# EAGLE design driverLED (EAGLE 6.3)
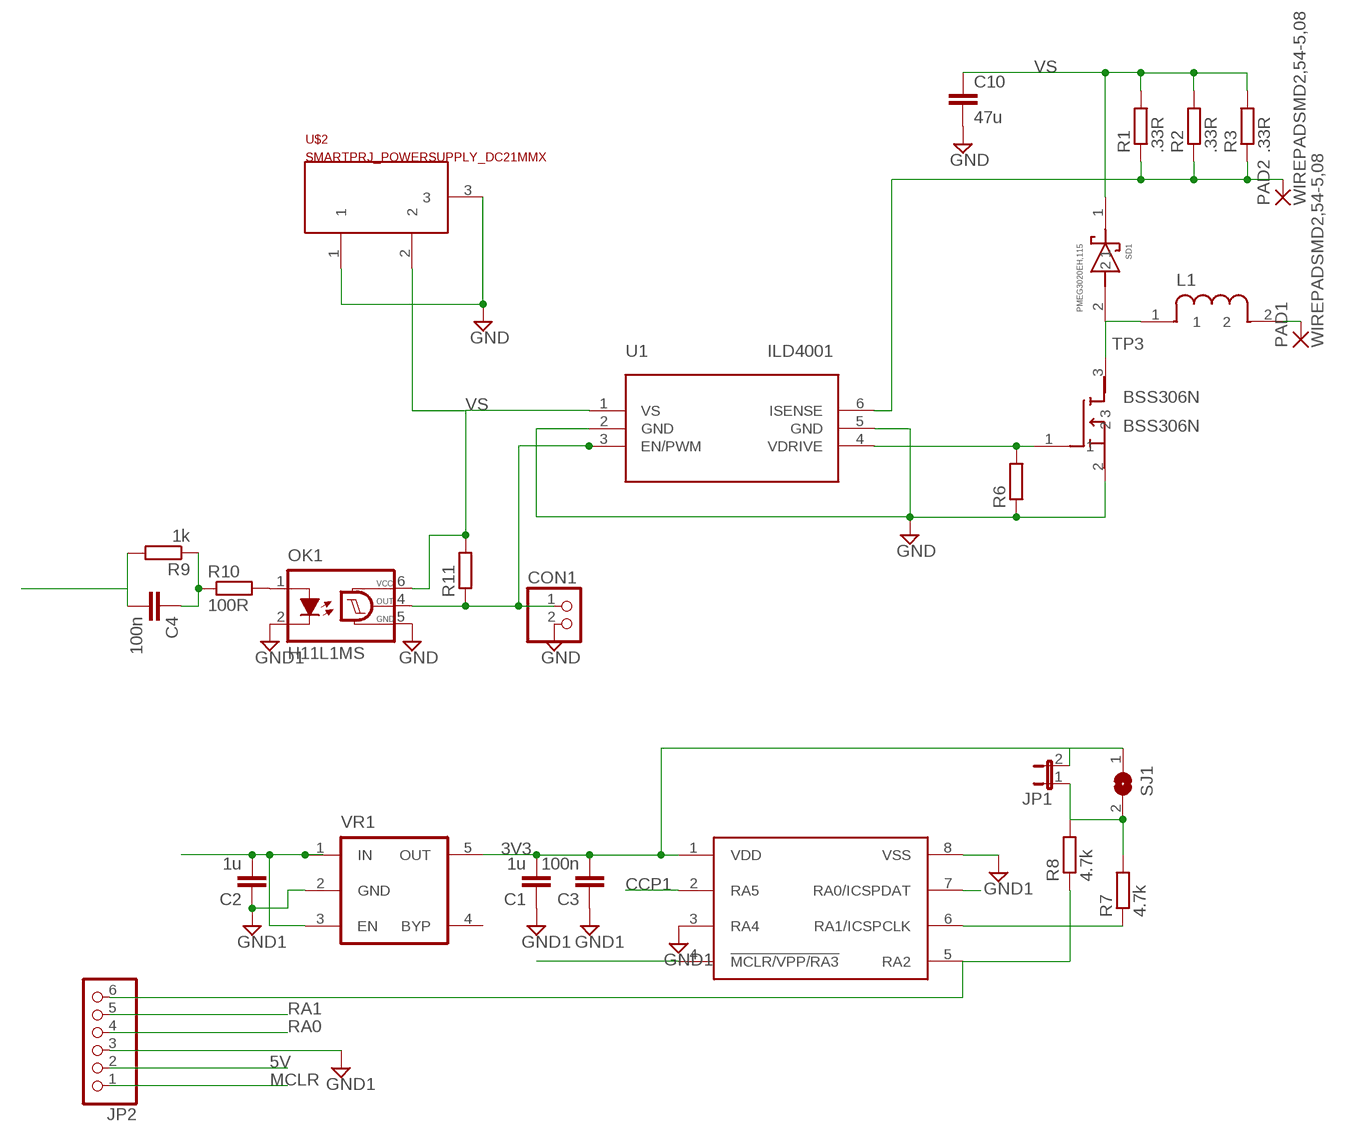
[diagram p0: schematic, sheet 1]

## Parts
BSS306N  BSS306N  [SOT23]
C1  1u  C-EUC0603  [C0603]
C2  1u  C-EUC0603  [C0603]
C3  100n  C-EUC0603  [C0603]
C4  100n  C-EUC0603  [C0603]
C10  47u  C-EUC1812  [C1812]
CON1  PINHD-1X2  [1X02]
JP1  JUMPER-2PTH  [1X02]
JP2  PINHD-1X6  [1X06]
L1  NR10050T470M  [NR10050T470M]
OK1  H11L1MS  [DIL6-SMD]
PAD1  WIREPADSMD2,54-5,08  [SMD2,54-5,08]
PAD2  WIREPADSMD2,54-5,08  [SMD2,54-5,08]
R1  .33R  R-EU_R1206  [R1206]
R2  .33R  R-EU_R1206  [R1206]
R3  .33R  R-EU_R1206  [R1206]
R6  R-EU_R0603  [R0603]
R7  4.7k  R-EU_R0603  [R0603]
R8  4.7k  R-EU_R0603  [R0603]
R9  1k  R-EU_R0603  [R0603]
R10  100R  R-EU_R0603  [R0603]
R11  R-EU_R0603  [R0603]
SD1  PMEG3020EH,115  [SOD123F]
SJ1  JUMPER_SJ  [JUMPER_SJ]
U1  ILD4001  [SC74]
U$1  PIC12F1822  [8-SOIC]
U$2  SMARTPRJ_POWERSUPPLY_DC21MMX  [SMARTPRJ_POWERSUPPLY_DC-21MM]
VR1  MIC5205  [SOT-23-5]

## Nets
3V3: C1.2 C3.2 JP1.2 SJ1.1 U$1.1(VDD) VR1.5(OUT)
5V: C2.2 JP2.2 VR1.1(IN) VR1.3(EN)
CCP1: C4.2 R9.2 U$1.2(RA5)
GND: BSS306N.2 C10.2 CON1.2 OK1.5(GND) R6.1 U1.2(GND) U1.5(GND) U$2.1 U$2.3
GND1: C1.1 C2.1 C3.1 JP2.3 OK1.2(C) U$1.3(RA4) U$1.8(VSS) VR1.2(GND)
MCLR: JP2.1 U$1.4(!MCLR/VPP/RA3)
N$1: OK1.1(A) R10.2
N$2: L1.2 PAD1.1(P)
N$4: BSS306N.1 R6.2 U1.4(VDRIVE)
N$8: JP1.1 R7.2 R8.2 SJ1.2
N$9: CON1.1 OK1.4(OUT) R11.1 U1.3(EN/PWM)
N$10: PAD2.1(P) R1.1 R2.1 R3.1 U1.6(ISENSE)
N$11: JP2.6 R8.1 U$1.5(RA2)
N$12: C4.1 R9.1 R10.1
RA0: JP2.4 U$1.7(RA0/ICSPDAT)
RA1: JP2.5 R7.1 U$1.6(RA1/ICSPCLK)
TP3: BSS306N.3 L1.1 SD1.2
VS: C10.1 OK1.6(VCC) R1.2 R2.2 R3.2 R11.2 SD1.1 U1.1(VS) U$2.2
Unconnected: VR1.4(BYP)

## Library data of the parts
BSS306N = lsel2014-2:BSS306N
C1-C4 C10 = resistor:C-EU: CAPACITOR, European symbol
CON1 = pinhead:PINHD-1X2: PIN HEADER
JP1 = SparkFun:JUMPER-2: Jumper Basic 0.1" spaced jumper. Use with breakaway headers.
JP2 = pinhead:PINHD-1X6: PIN HEADER
L1 = lsel2014-2:NR10050T470M
OK1 = optocoupler:H11L*M: 6-Pin DIP Optocoupler Source: http://www.fairchildsemi.com/ds/H1/H11L2-M.pdf; OC_FARNELL: unknown; OC_NEWARK: unknown
PAD1 PAD2 = wirepad:WIREPAD: Wire PAD connect wire on PCB
R1-R3 R10 = rcl:R-EU_: RESISTOR, European symbol
R6-R9 R11 = resistor:R-EU_: RESISTOR, European symbol
SD1 = lsel2014-2:PMEG3020EH,115
SJ1 = ADK_MEGA_2560-REV3:JUMPER_SJ: SMD solder JUMPER
U1 = lsel2014-2:ILD4001
U$1 = lsel2014-2:PIC12F1822
U$2 = Armduino_v1.3:SMARTPRJ_POWERSUPPLY_DC21MM
VR1 = dp_devices:MIC5205: 150ma Low-Noise LDO Regulator

## Board
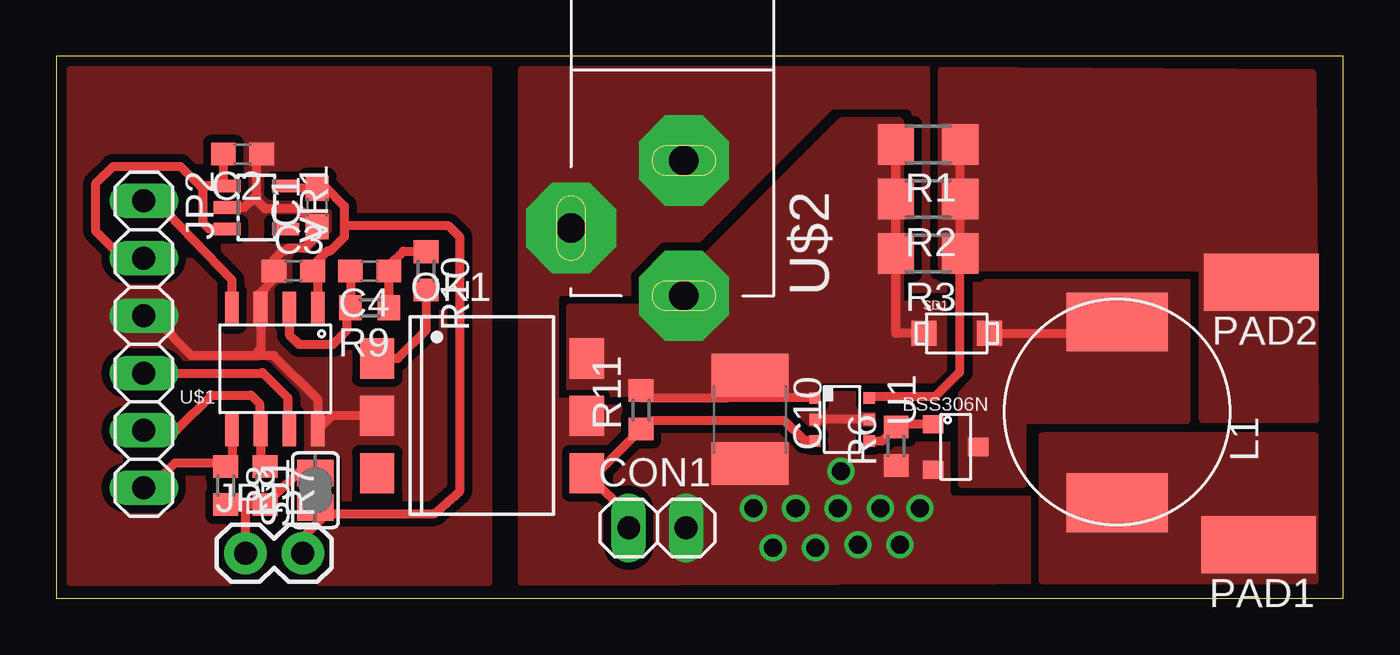
[diagram p1: board, top side]
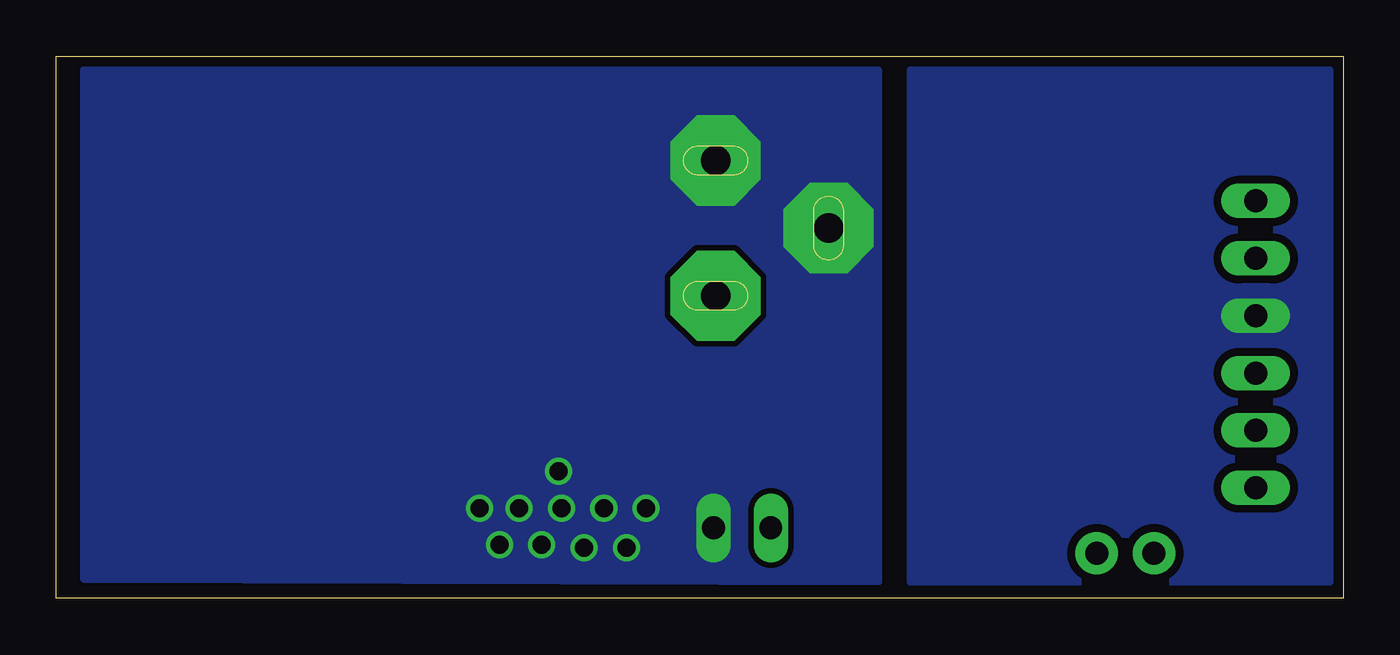
[diagram p2: board, bottom side, seen from below]

Size 57 x 24 mm. Coordinates in mm from the lower left corner, seen from the top.
Outline: 0,0 57,0 57,24 0,24 0,0
Copper layers (1*16): Top 0.035mm / dielectric 1.5mm / Bottom 0.035mm
Design rules "Fusion_eagle_rule_v1.1": minimum track width 6mil, minimum drill 0.3mm, track to track 6mil, track to pad 6mil, pad to pad 6mil, via to via 6mil, smd to smd 0mil, copper to edge 10mil, drill to drill 10mil, minimum pad ring 10mil, minimum via ring 6mil, stop-mask expansion 2mil, vias tented up to drill 100mil, thermal gap 10mil

### Footprints (pad centres in the part's own frame; a part is rotated, then mirrored left to right if it is on the bottom)
SOT23 = smd 0.9 x 0.8: 1 -0.4,1.3; 2 -0.4,-0.7; 3 1.6,0.3
C0603 = smd 1.1 x 1: 1 -0.85,0; 2 0.85,0
C1812 = smd 1.9 x 3.4: 1 -1.95,0; 2 1.95,0
1X02 = drill 1.016 long: 1 -1.27,0; 2 1.27,0
1X02' = drill 1.016 pad 1.88: 1 0,0; 2 2.54,0
1X06 = drill 1.016 long: 1 -6.35,0; 2 -3.81,0; 3 -1.27,0; 4 1.27,0; 5 3.81,0; 6 6.35,0
NR10050T470M = smd 2.6 x 4.5: 1 -4.19,0; 2 3.81,0
DIL6-SMD = smd 1.78 x 1.52: 1 -2.54,-4.645; 2 0,-4.645; 3 2.54,-4.645; 4 2.54,4.645; 5 0,4.645; 6 -2.54,4.645
SMD2,54-5,08 = smd 2.54 x 5.08: 1 0,0
R1206 = smd 1.6 x 1.803: 1 -1.422,0; 2 1.422,0
R0603 = smd 1 x 1.1: 1 -0.85,0; 2 0.85,0
SOD123F = smd 1.1 x 1.1: 1 -1.45,0; 2 1.45,0
JUMPER_SJ = smd 1.168 x 1.6: 1 -0.762,0; 2 0.762,0
SC74 = smd 0.5 x 0.5: 1 -0.95,-1.2; 2 0,-1.2; 3 0.95,-1.2; 4 0.95,1.2; 5 0,1.2; 6 -0.95,1.2
8-SOIC = smd 0.6 x 1.5: 1 -1.843,-2.71; 2 -0.573,-2.71; 3 0.698,-2.71; 4 1.968,-2.71; 5 1.968,2.63; 6 0.698,2.63; 7 -0.573,2.63; 8 -1.843,2.63
SMARTPRJ_POWERSUPPLY_DC-21MM = drill 1.3 pad 4 octagon: 1 -5.08,-3.353; 2 -0.076,-6.35; 3 -0.076,-0.356
SOT-23-5 = smd 0.55 x 1.2: 1 -0.95,-1.3; 2 0,-1.3; 3 0.95,-1.3; 4 0.95,1.3; 5 -0.95,1.3

### Placement (x,y rotation side)
BSS306N  39.24,6.41 0 top
C1  11.55,17.32 90 top
C2  8.24,19.68 180 top
C3  10.5,14.5 0 top
C4  13.88,14.5 180 top
C10  30.73,7.92 270 top
CON1  26.62,3.12 0 top
JP1  [1X02']  8.38,2 0 top
JP2  3.88,11.25 270 top
L1  46.98,8.05 270 top
OK1  18.85,8.09 270 top
PAD1  53.25,2.38 90 top
PAD2  53.38,14 90 top
R1  38.62,20.11 180 top
R2  38.62,17.69 180 top
R3  38.62,15.28 180 top
R6  37.2,6.74 90 top
R7  9.25,5 270 top
R8  7.5,5 270 top
R9  13.88,12.88 180 top
R10  16.38,14.5 270 top
R11  25.9,8.35 90 top
SD1  39.88,11.73 0 top
SJ1  11.47,4.79 90 top
U1  34.8,7.92 270 top
U$1  9.74,10.12 180 top
U$2  27.88,19.75 0 top
VR1  8.86,17.32 270 top

### Tracks (layer width: path | path; a pad name or v marks a point on that pad's centre or on a via)
3V3
  Top 0.406: 11.62,13 11.59,12.96 U$1.1 11.59,14.26 C3.2 11.35,14.72 12,15.38 12.12,15.38 12.75,16 12.75,16.38 | VR1.5 10.26,18.16 C1.2 11.96,18.16 12.75,17.38 12.75,16.38 | 12.75,16.38 12.88,16.5 17.38,16.5 17.88,16 17.88,4.75 16.75,3.75 12.25,3.75 10.99,4.01 11.86,3.64 | 11.86,3.64 SJ1.1 | JP1.2 10.91,2.69 11.86,3.64
5V
  Top 0.406: JP2.2 2.94,15.06 1.75,16.25 1.75,18.38 2.5,19.12 5.5,19.12 6.36,18.27 6.5,18.27 | C2.2 7.39,18.36 VR1.1 6.5,18.27 | VR1.3 6.76,16.36 6.5,16.62 6.5,18.12 | 6.5,18.12 6.62,18.25 | 6.5,18.12 6.5,18.27
CCP1
  Top 0.406: U$1.2 10.32,11.68 10.75,11.25 12.25,11.25 12.88,11.88 12.88,12.79 R9.2 C4.2
GND  (via drill 0.8)
  Top 0.406: U1.5 U1.2
  other vias: 30.88,4 32.75,4 34.62,4 36.5,4 38.25,4 34.75,5.62 33.62,2.25 35.5,2.38 37.38,2.38 31.75,2.25
  pour Top (isolate 0.35, rank 4, no thermals): 55.75,23.38 20.62,23.38 20.62,0.75 55.75,0.88
  pour Bottom (isolate 0.25, rank 4, no thermals): 55.75,23.38 20.62,23.38 20.62,0.75 55.75,0.88
GND1
  Top 0.406: 8.75,10.75 9.62,10.75 11.59,8.79 U$1.8 12.18,8.09 OK1.2 | 8.75,10.75 6,10.75 4.38,12.38 4.02,12.38 JP2.3 | 8.75,10.75 9.05,11.05 U$1.3 9,12.88 9,13.5 9.65,14.15 C3.1 | VR1.2 8.31,17.32 8.75,17.75 | 8.75,17.75 8.88,17.88 8.88,19.45 C2.1 | 8.75,17.75 9.25,17.25 10.75,17.25 11.54,16.46 C1.1 11.55,16.05 11,15.5 10.25,15.5 10.12,15.38 10,15.38 9.62,15 9.62,14.62 | 9.75,14.5 9.62,14.62 | 9.62,14.62 9.62,14.5
  pour Top (isolate 0.35, no thermals): 19.12,23.38 0.62,23.38 0.62,0.75 19.12,0.75
  pour Bottom (isolate 0.35, no thermals): 19.12,23.38 0.62,23.38 0.62,0.75 19.12,0.75
MCLR
  Top 0.406: U$1.4 7.78,14.1 4.38,17.62 3.9,17.62 JP2.1
N$1
  Top 0.406: OK1.1 15.12,10.62 16.38,11.88 R10.2
N$2
  pour Top (isolate 0.25, rank 3, no thermals): 43.7,7.16 43.7,0.82 55.73,0.82 55.73,7.16
N$4
  Top 0.406: BSS306N.1 37.31,7.71 R6.2 36.59,6.97 U1.4
N$8
  Top 0.406: 8.5,4.15 R7.2 9.85,4.75 9.88,4.75 10.68,5.55 SJ1.2 | 8.5,4.15 R8.2 | JP1.1 8.38,4.03 8.5,4.15
N$9
  Top 0.406: U1.3 33.15,6.97 32.25,7.88 26.27,7.88 R11.1 23.95,5.54 OK1.4 25.48,3.56 25.36,3.44 CON1.1
N$10
  Top 0.406: 39.88,19.36 R1.1 R3.1 40.01,14.28 40.01,10.01 38.95,8.95 36.01,8.95 U1.6
  pour Top (isolate 0.34, no thermals): 39.26,14.67 39.26,23.38 55.6,23.25 55.73,7.95 50.81,7.95 50.81,14.67
N$11
  Top 0.406: U$1.5 7.78,6.13 R8.1 7.35,6 5.25,6 4.26,4.99 4.17,4.9 JP2.6
N$12
  Top 0.406: R9.1 C4.1 14.72,14.72 15.38,15.38 16.35,15.38 R10.1
RA0
  Top 0.406: U$1.7 10.25,7.56 10.25,8.88 9.12,10 9.11,9.98 JP2.4
RA1
  Top 0.406: R7.1 9.05,6.05 U$1.6 9,7.54 9,8.62 8.62,9 6.88,9 5.32,7.44 JP2.5
TP3
  Top 0.406: SD1.2 46.23,11.73 L1.1
  pour Top (isolate 0.35, rank 2, no thermals): 40.13,9.03 40.13,5.09 42.8,5.09 42.8,7.92 50.05,7.92 50.05,14.28 40.78,14.28 40.78,9.78
VS
  Top 0.406: R1.2 R3.2 37.19,11.73 SD1.1 | U1.1 29.73,8.88 | 29.73,9.2 C10.1 29.73,8.88 | 25.91,8.88 29.73,8.88
  pour Top (isolate 0.25, no thermals): 33.53,9.2 22.79,9.07 22.79,12.88 26.55,12.88 34.8,21.12 37.34,21.12 37.34,13.01 39.24,13.01 39.24,9.71 33.53,9.71